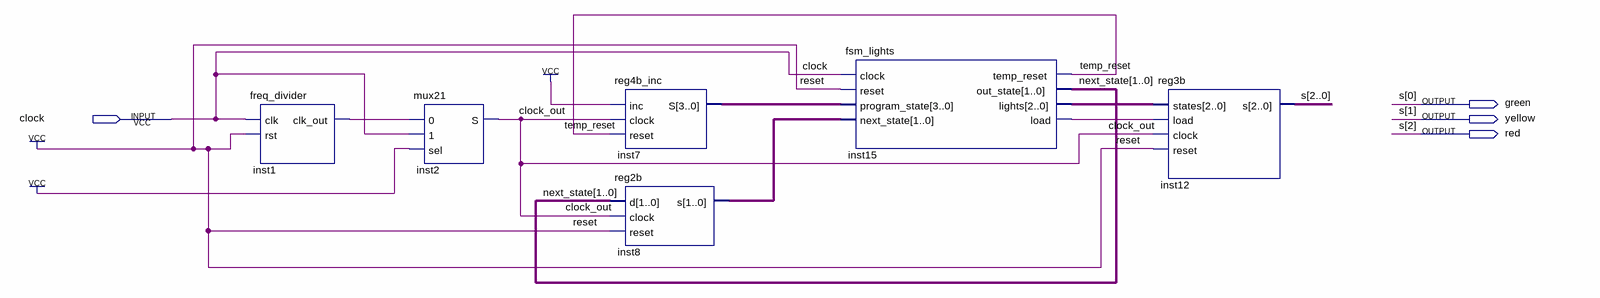
[diagram p0: schematic sheet]
// Quartus schematic TrafficLights.bdf as structural Verilog: 6 symbols, 4 pins
module TrafficLights (
  input  clock,
  output green,
  output yellow,
  output red
);

  wire clock_out, inst1_clk_out, inst15_load, temp_reset;
  wire [1:0] inst8_s, next_state;
  wire [2:0] inst15_lights;
  wire [3:0] inst7_s;

  freq_divider inst1 (.clk(clock), .rst(1'b1), .clk_out(inst1_clk_out));
  mux21 inst2 (.\0 (inst1_clk_out), .\1 (clock), .sel(1'b1), .S(clock_out));
  reg4b_inc inst7 (.inc(1'b1), .clock(clock_out), .reset(temp_reset), .S(inst7_s));
  reg2b inst8 (.d(next_state), .clock(clock_out), .reset(1'b1), .s(inst8_s));
  fsm_lights inst15 (
    .clock(clock), .reset(1'b1), .program_state(inst7_s), .next_state(inst8_s), .temp_reset(temp_reset),
    .out_state(next_state), .lights(inst15_lights), .load(inst15_load));
  reg3b inst12 (.states(inst15_lights), .load(inst15_load), .clock(clock_out), .reset(1'b1), .s({red, yellow, green}));

  // Other names for the same wires on the sheet: s[2:0] = {red, yellow, green}
endmodule
